# EAGLE schematic main (EAGLE 8.1.0)
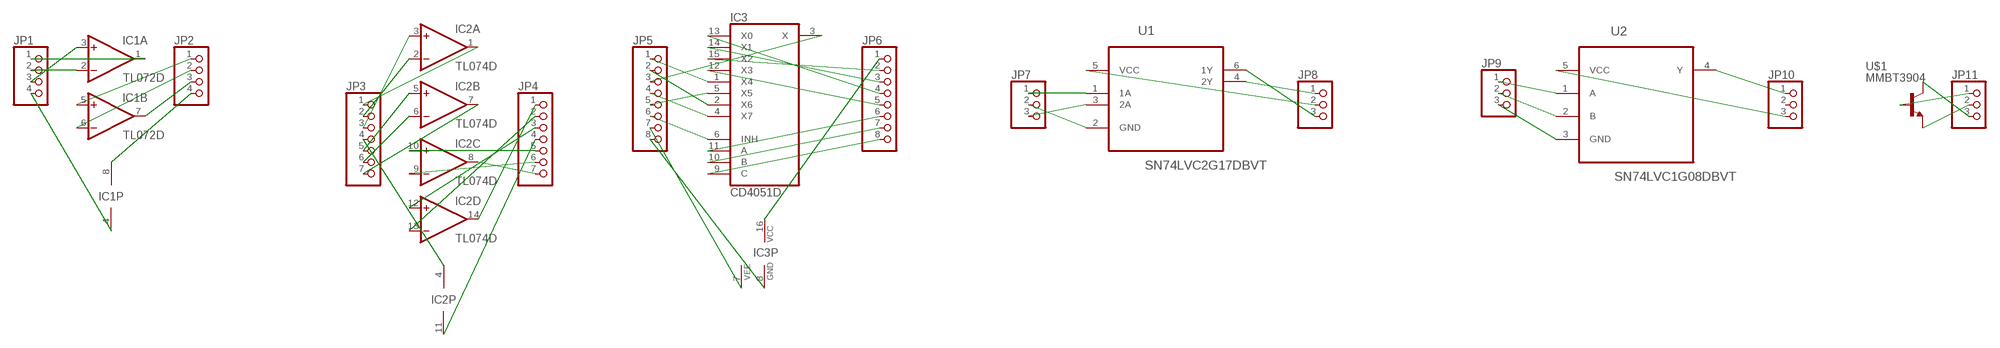
[diagram p0: schematic, sheet 1]

## Parts
IC1  TL072D  [SO08]
IC2  TL074D  [SO14]
IC3  CD4051D  [SO16]
JP1  PINHD-1X4/OCT  [1X04/OCT]
JP2  PINHD-1X4/OCT  [1X04/OCT]
JP3  PINHD-1X7/OCT  [1X07/OCT]
JP4  PINHD-1X7/OCT  [1X07/OCT]
JP5  PINHD-1X8  [1X08]
JP6  PINHD-1X8  [1X08]
JP7  PINHD-1X3/OCT  [1X03/OCT]
JP8  PINHD-1X3/OCT  [1X03/OCT]
JP9  PINHD-1X3/OCT  [1X03/OCT]
JP10  PINHD-1X3/OCT  [1X03/OCT]
JP11  PINHD-1X3/OCT  [1X03/OCT]
U1  SN74LVC2G17DBVT  [SOT95P280X145-6N]
U2  SN74LVC1G08DBVT  [SOT95P280X145-5N]
U$1  MMBT3904  [SOT23]

## Nets
N$1: IC1.1(A:OUT) JP1.1
N$2: IC1.2(A:-IN) JP1.2
N$3: IC1.3(A:+IN) JP1.3
N$4: IC1.4(P:V-) JP1.4
N$5: IC1.5(B:+IN) JP2.1
N$6: IC1.6(B:-IN) JP2.2
N$7: IC1.7(B:OUT) JP2.3
N$8: IC1.8(P:V+) JP2.4
N$9: IC2.1(A:OUT) JP3.1
N$10: IC2.2(A:-IN) JP3.2
N$11: IC2.3(A:+IN) JP3.3
N$12: IC2.4(P:V+) JP3.4
N$13: IC2.5(B:+IN) JP3.5
N$14: IC2.6(B:-IN) JP3.6
N$15: IC2.7(B:OUT) JP3.7
N$16: IC2.8(C:OUT) JP4.7
N$17: IC2.9(C:-IN) JP4.6
N$18: IC2.10(C:+IN) JP4.5
N$19: IC2.11(P:V-) JP4.4
N$20: IC2.12(D:+IN) JP4.3
N$21: IC2.13(D:-IN) JP4.2
N$22: IC2.14(D:OUT) JP4.1
N$23: IC3.1(X4) JP5.1
N$24: IC3.2(X6) JP5.2
N$25: IC3.3(X) JP5.3
N$26: IC3.4(X7) JP5.4
N$27: IC3.5(X5) JP5.5
N$28: IC3.6(INH) JP5.6
N$29: IC3.7(VEE) JP5.7
N$30: IC3.8(GND) JP5.8
N$31: IC3.9(C) JP6.8
N$32: IC3.10(B) JP6.7
N$33: IC3.11(A) JP6.6
N$34: IC3.12(X3) JP6.5
N$35: IC3.13(X0) JP6.4
N$36: IC3.14(X1) JP6.3
N$37: IC3.15(X2) JP6.2
N$38: IC3.16(VCC) JP6.1
N$39: JP7.1 U1.1(1A)
N$40: JP7.2 U1.2(GND)
N$41: JP7.3 U1.3(2A)
N$42: JP8.1 U1.4(2Y)
N$43: JP8.2 U1.5(VCC)
N$44: JP8.3 U1.6(1Y)
N$45: JP9.1 U2.1(A)
N$46: JP9.2 U2.2(B)
N$47: JP9.3 U2.3(GND)
N$48: JP10.1 U2.4(Y)
N$49: JP10.3 U2.5(VCC)
N$50: JP11.1 U$1.1(B)
N$51: JP11.2 U$1.2(E)
N$52: JP11.3 U$1.3(C)
Unconnected: JP10.2

## Library data of the parts
IC1 = _JC:TL072: OP AMP
IC2 = _JC:TL074: OP AMP
IC3 = _JC:CD4051: 8-channel ANALOG MULTIPLEXER
JP1 JP2 = _JC:PINHD-1X4: PIN HEADER
JP3 JP4 = _JC:PINHD-1X7: PIN HEADER
JP5 JP6 = _JC:PINHD-1X8: PIN HEADER
JP7-JP11 = _JC:PINHD-1X3: PIN HEADER
U1 = _JC:SN74LVC2G17DBVT: DUAL SCHMITT-TRIGGER BUFFER; MPN: SN74LVC2G17DBVT; OC_FARNELL: 1739699; OC_NEWARK: 34R8936; PACKAGE: SOT-23-6; SUPPLIER: Texas Instruments
U2 = _JC:SN74LVC1G08DBVT: SINGLE 2-INPUT POSITIVE-AND GATE; MPN: SN74LVC1G08DBVT; OC_FARNELL: 1236324; OC_NEWARK: 32H6345; PACKAGE: SOT-23-5; SUPPLIER: Texas Instruments
U$1 = _JC:MMBT3904